# EAGLE design nucleo_jlink (EAGLE 7.5.0)
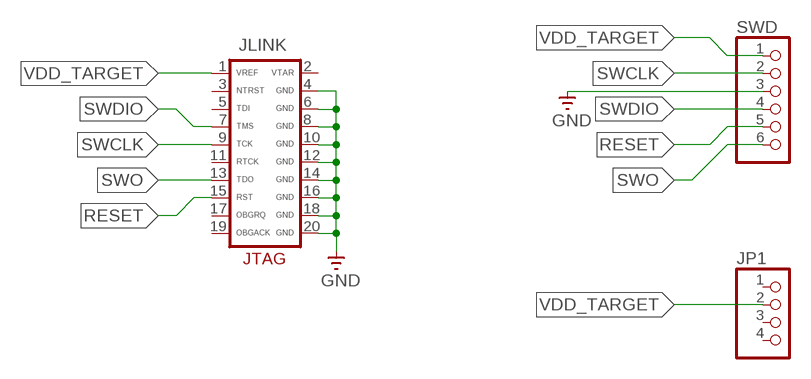
[diagram p0: schematic, sheet 1]

## Parts
JLINK  JTAG-ARM  [JTAG-ARM]
JP1  PINHD-1X4  [1X04]
SWD  PINHD-1X6  [1X06]

## Nets
GND: JLINK.4(GND) JLINK.6(GND) JLINK.8(GND) JLINK.10(GND) JLINK.12(GND) JLINK.14(GND) JLINK.16(GND) JLINK.18(GND) JLINK.20(GND) SWD.3
RESET: JLINK.15(RST) SWD.5
SWCLK: JLINK.9(TCK) SWD.2
SWDIO: JLINK.7(TMS) SWD.4
SWO: JLINK.13(TDO) SWD.6
VDD_TARGET: JLINK.1(VREF) JP1.2 SWD.1
Unconnected: JLINK.2(VTAR) JLINK.3(NTRST) JLINK.5(TDI) JLINK.11(RTCK) JLINK.17(OBGRQ) JLINK.19(OBGACK) JP1.1 JP1.3 JP1.4

## Library data of the parts
JLINK = conn-user:JTAG-ARM: JTAG Programming/Debug Connector
JP1 = conn-user:PINHD-1X4: PIN HEADER
SWD = conn-user:PINHD-1X6: PIN HEADER

## Board
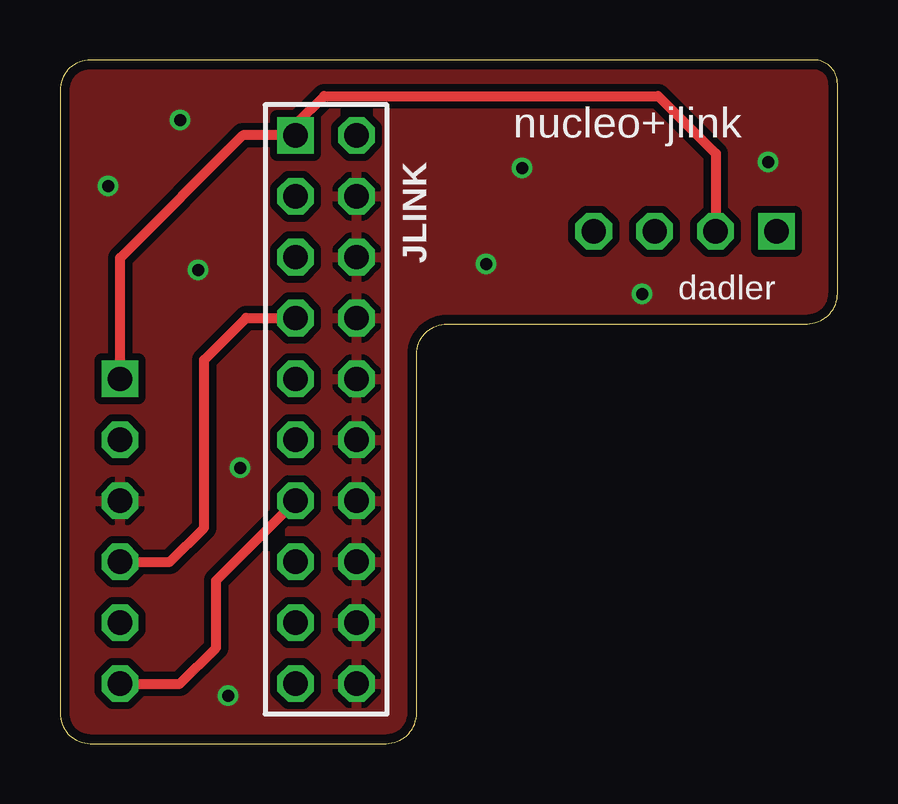
[diagram p1: board, top side]
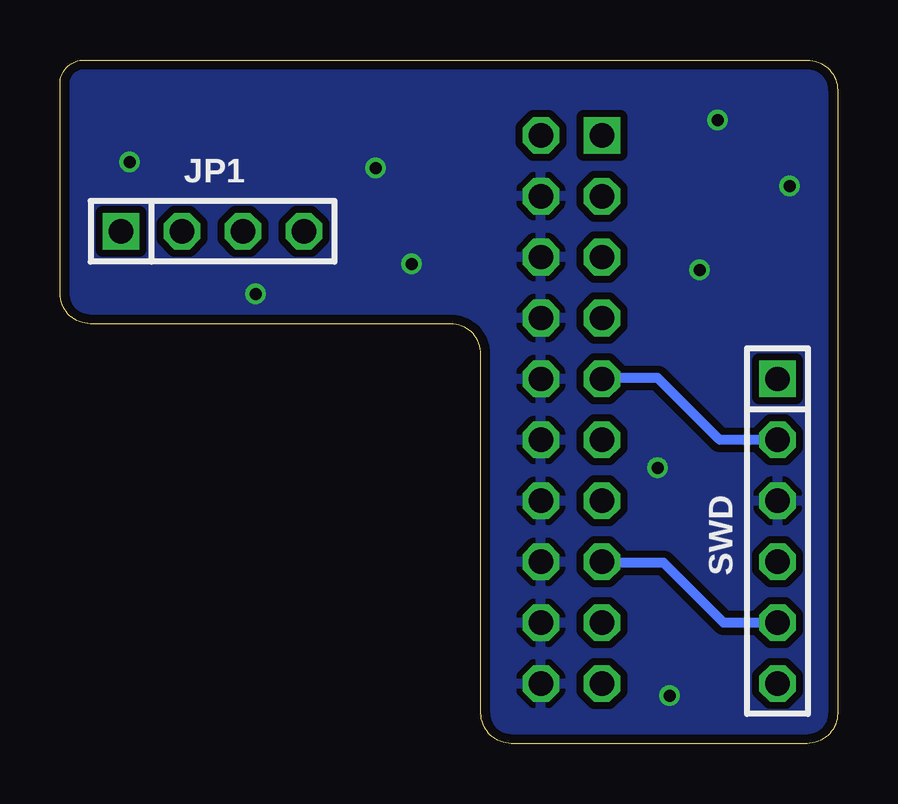
[diagram p2: board, bottom side, seen from below]

Size 32.4 x 28.5 mm. Coordinates in mm from the lower left corner, seen from the top.
Outline: 31.4,28.5 1.27,28.5 arc90 0,27.23 0,1.27 arc90 1.27,0 13.59,0 arc90 14.86,1.27 14.86,16.23 arc-90 16.13,17.5 31.13,17.5 arc90 32.4,18.77 32.4,27.5 arc90 31.4,28.5
Copper layers (1*16): Top 0.0356mm / dielectric 1.5011mm / Bottom 0.0356mm
Design rules "oshpark-2layer-user": minimum track width 6mil, minimum drill 13mil, track to track 6mil, track to pad 6mil, pad to pad 6mil, via to via 6mil, smd to smd 0mil, copper to edge 15mil, drill to drill 6mil, minimum pad ring 7mil, minimum via ring 7mil, stop-mask expansion 2.5mil, vias tented up to drill 30mil, thermal gap 10mil

### Footprints (pad centres in the part's own frame; a part is rotated, then mirrored left to right if it is on the bottom)
JTAG-ARM = drill 1.016 square: 1 -11.43,-1.27 | drill 1.016 octagon: 2 -11.43,1.27; 3 -8.89,-1.27; 4 -8.89,1.27; 5 -6.35,-1.27; 6 -6.35,1.27; 7 -3.81,-1.27; 8 -3.81,1.27; 9 -1.27,-1.27; 10 -1.27,1.27; 11 1.27,-1.27; 12 1.27,1.27; 13 3.81,-1.27; 14 3.81,1.27; 15 6.35,-1.27; 16 6.35,1.27; 17 8.89,-1.27; 18 8.89,1.27; 19 11.43,-1.27; 20 11.43,1.27
1X04 = drill 1.016 square: 1 -3.81,0 | drill 1.016 octagon: 2 -1.27,0; 3 1.27,0; 4 3.81,0
1X06 = drill 1.016 square: 1 -6.35,0 | drill 1.016 octagon: 2 -3.81,0; 3 -1.27,0; 4 1.27,0; 5 3.81,0; 6 6.35,0

### Placement (x,y rotation side)
JLINK  11.09,13.93 270 top
JP1  26.05,21.36 0 bottom
SWD  2.5,8.85 270 bottom

### Tracks (layer width: path | path; a pad name or v marks a point on that pad's centre or on a via)
GND  (via drill 0.5)
  other vias: 7,2 5.75,19.75 2,23.25 7.5,11.5 19.25,24 17.75,20 29.5,24.25 5,26 24.25,18.75
  pour Bottom (isolate 0.305): 14.86,17.27 14.86,1.27 arc-90 13.59,0 1.27,0 arc-90 0,1.27 0,27.23 arc-90 1.27,28.5 31.13,28.5 arc-90 32.4,27.23 32.4,17.5 arc45 32.38,17.51 14.85,17.51 arc45
  pour Top (isolate 0.305): 0,0 0,28.5 32.4,28.5 32.4,17.5 14.86,17.5 14.86,0
RESET
  Bottom 0.406: SWD.5 4.75,5.04 7.25,7.54 9.78,7.54 JLINK.15
SWCLK
  Bottom 0.406: SWD.2 4.91,12.66 7.5,15.25 9.77,15.25 JLINK.9
SWDIO
  Top 0.406: SWD.4 4.58,7.58 6,9 6,16 7.75,17.75 JLINK.7
SWO
  Top 0.406: SWD.6 5,2.5 6.5,4 6.5,6.8 JLINK.13
VDD_TARGET
  Top 0.406: SWD.1 2.5,20.25 7.62,25.36 JLINK.1 9.82,25.82 11,27 24.92,27 27.32,24.6 JP1.2

### Text on the board
tPlace: nucleo+jlink | dadler